# Altium schematic sheet OSP_Carrier_V8_Power.SchDoc: OSP_Carrier_V8
size B; ApprovedBy: HARI; Engineer: LP; Organization: THE_Lab; DocumentNumber: 1; Revision: 1; SheetNumber: 1; SheetTotal: 1
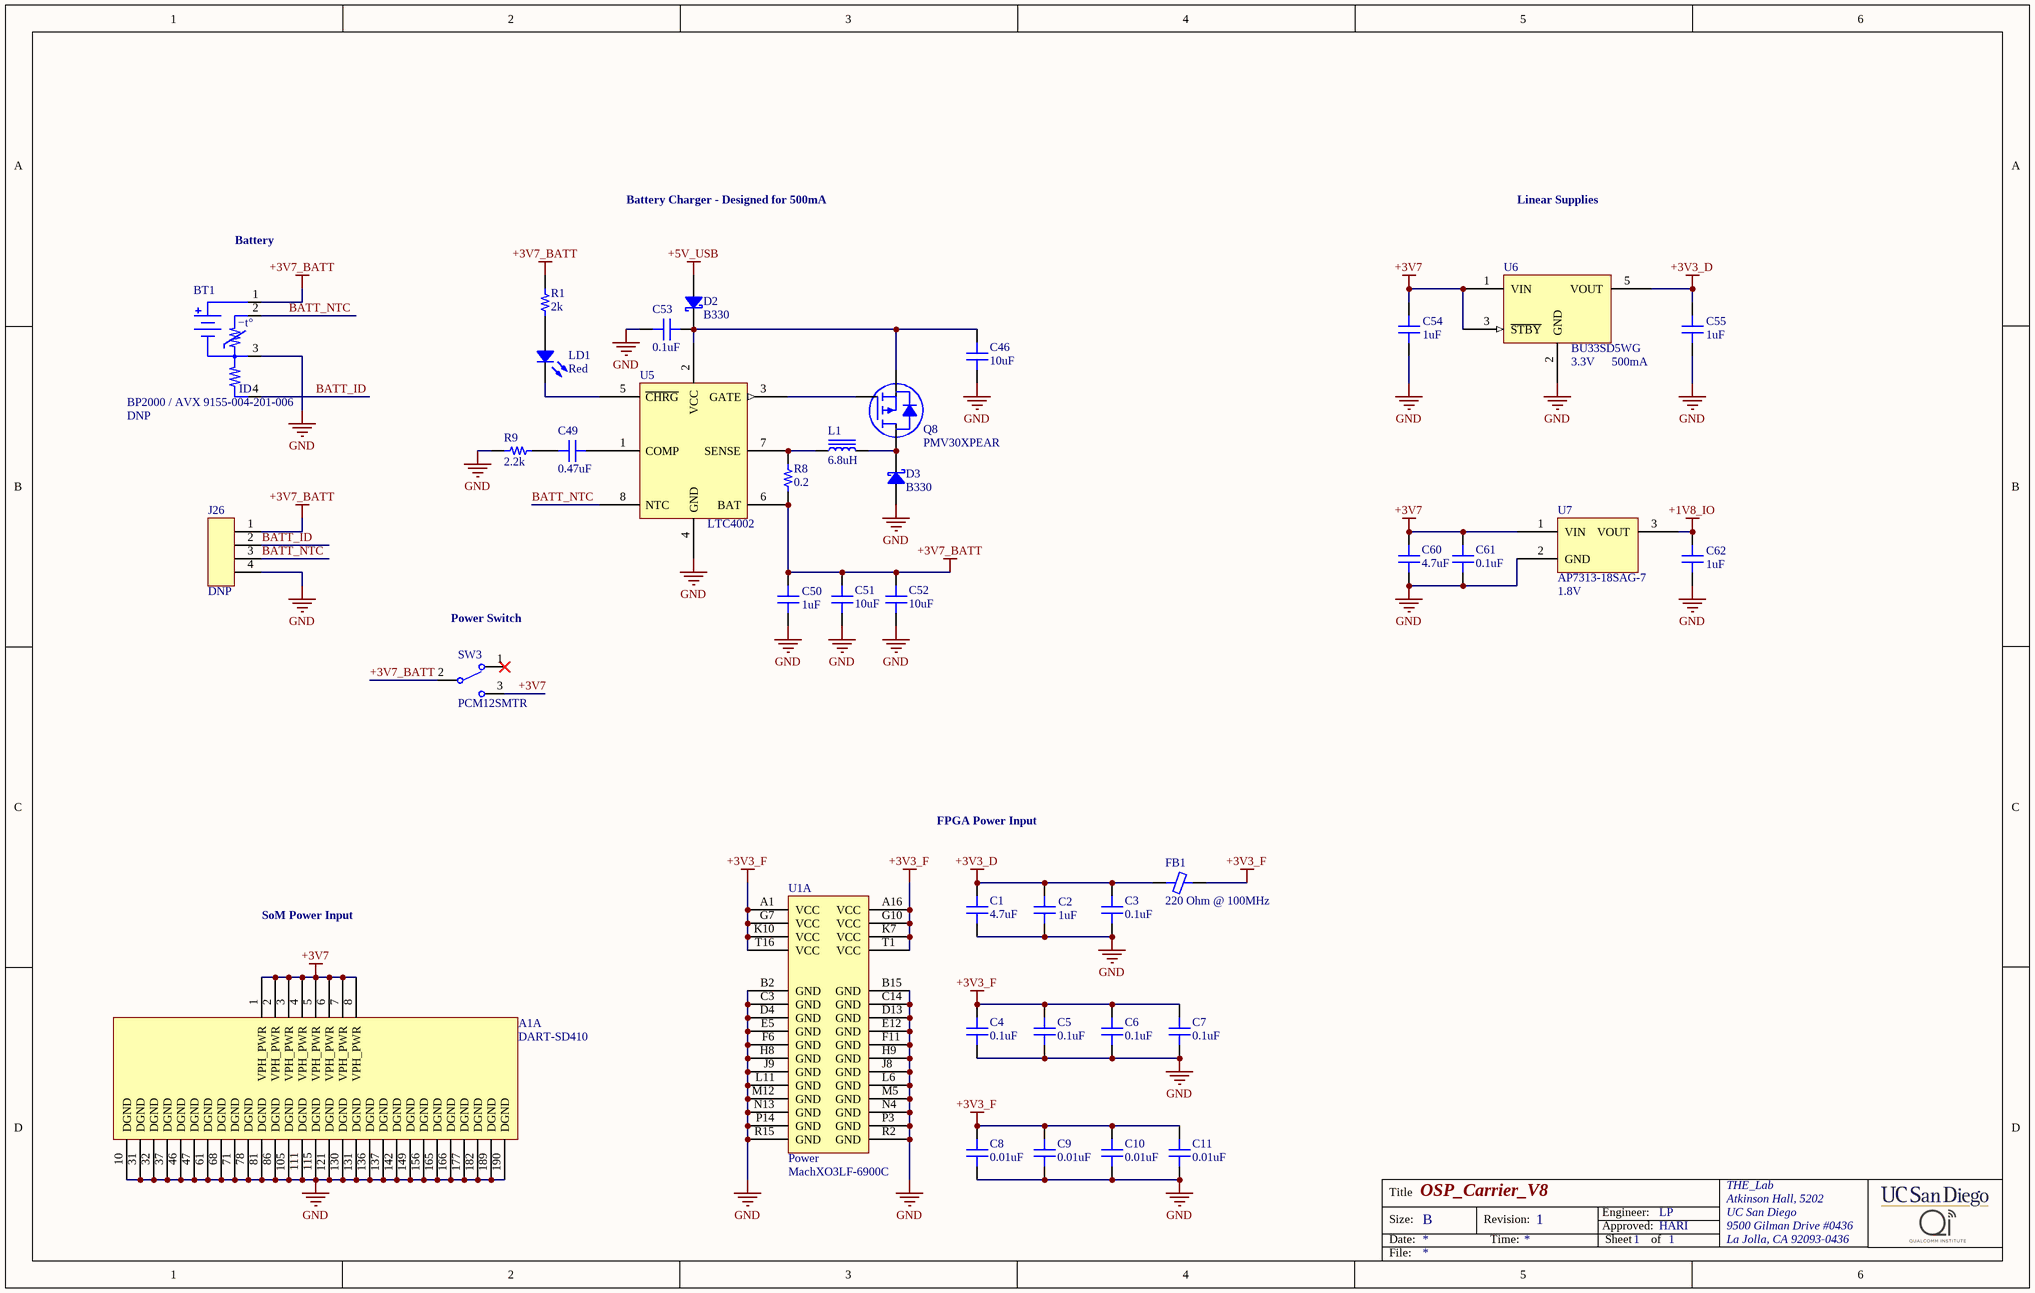
[diagram p0: OSP_Carrier_V8_Power.SchDoc]

## Parts
A1  DART-SD410  [DART-SD410]  (part A of 15)
BT1  BP2000 / AVX 9155-004-201-006  [SAMSUNG_BP2000]
C1  4.7uF  [CAP 0402/1005]
C2  1uF  [CAP 0402/1005]
C3  0.1uF  [CAP 0402/1005]
C4  0.1uF  [CAP 0402/1005]
C5  0.1uF  [CAP 0402/1005]
C6  0.1uF  [CAP 0402/1005]
C7  0.1uF  [CAP 0402/1005]
C8  0.01uF  [CAP 0402/1005]
C9  0.01uF  [CAP 0402/1005]
C10  0.01uF  [CAP 0402/1005]
C11  0.01uF  [CAP 0402/1005]
C46  10uF  [CAP 1206/3216]
C49  0.47uF  [CAP 0402/1005]
C50  1uF  [CAP 0402/1005]
C51  10uF  [CAP 1206/3216]
C52  10uF  [CAP 1206/3216]
C53  0.1uF  [CAP 0402/1005]
C54  1uF  [CAP 0402/1005]
C55  1uF  [CAP 0402/1005]
C60  4.7uF  [CAP 0402/1005]
C61  0.1uF  [CAP 0402/1005]
C62  1uF  [CAP 0402/1005]
D2  B330  [DO214AC SMA]
D3  B330  [DO214AC SMA]
FB1  220 Ohm @ 100MHz  [FER 0402/1005]
J26  Shallow  [AMPHENOL_10125839-04RAEHLF_DNP]  (value not drawn)
L1  6.8uH  [LAIRD_TYS6028]
LD1  Red  [LED 0603/1608 RED]
Q8  PMV30XPEAR  [NXP_SOT23]
R1  2k  [RES 0402/1005]
R8  0.2  [STACKPOLE CSR1206]
R9  2.2k  [RES 0402/1005]
SW3  PCM12SMTR  [*SW_PCM12SMTR_PCM12SMTR(Primary)]
U1  MachXO3LF-6900C  [LCMXO3_caBGA_BG256]  (part A of 7)
U5  LTC4002  [AD_LT_S8]
U6  BU33SD5WG  VOLTAGE: 3.3V  CURRENT: 500mA  [ROHM_SSOP5]
U7  AP7313-18SAG-7  Voltage - Output: 1.8V  [DIODES SOT-23-3]

## Nets
+1V8_IO: C62.1 U7.3(VOUT)
+3V3_D: C1.2 C2.1 C3.2 C55.1 FB1.1 U6.5(VOUT)
+3V3_F: C4.2 C5.2 C6.2 C7.2 C8.2 C9.2 C10.2 C11.2 FB1.2 U1.A1(VCC) U1.A16(VCC) U1.G7(VCC) U1.G10(VCC) U1.K7(VCC) U1.K10(VCC) U1.T1(VCC) U1.T16(VCC)
+3V7: A1.1(VPH_PWR) A1.2(VPH_PWR) A1.3(VPH_PWR) A1.4(VPH_PWR) A1.5(VPH_PWR) A1.6(VPH_PWR) A1.7(VPH_PWR) A1.8(VPH_PWR) C54.1 C60.2 C61.2 SW3.3 U6.1(VIN) U6.3(~{STBY}) U7.1(VIN)
+3V7_BATT: BT1.1(+) C50.1 C51.1 C52.1 J26.1 R1.2 R8.1 SW3.2 U5.6(BAT)
+5V_USB: D2.1
GND: A1.10(DGND) A1.31(DGND) A1.32(DGND) A1.37(DGND) A1.46(DGND) A1.47(DGND) A1.61(DGND) A1.68(DGND) A1.71(DGND) A1.78(DGND) A1.81(DGND) A1.86(DGND) A1.105(DGND) A1.111(DGND) A1.115(DGND) A1.121(DGND) A1.130(DGND) A1.131(DGND) A1.136(DGND) A1.137(DGND) A1.142(DGND) A1.149(DGND) A1.156(DGND) A1.165(DGND) A1.166(DGND) A1.177(DGND) A1.182(DGND) A1.189(DGND) A1.190(DGND) BT1.3(−) C1.1 C2.2 C3.1 C4.1 C5.1 C6.1 C7.1 C8.1 C9.1 C10.1 C11.1 C46.2 C50.2 C51.2 C52.2 C53.2 C54.2 C55.2 C60.1 C61.1 C62.2 D3.1 J26.4 R9.2 U1.B2(GND) U1.B15(GND) U1.C3(GND) U1.C14(GND) U1.D4(GND) U1.D13(GND) U1.E5(GND) U1.E12(GND) U1.F6(GND) U1.F11(GND) U1.H8(GND) U1.H9(GND) U1.J8(GND) U1.J9(GND) U1.L6(GND) U1.L11(GND) U1.M5(GND) U1.M12(GND) U1.N4(GND) U1.N13(GND) U1.P3(GND) U1.P14(GND) U1.R2(GND) U1.R15(GND) U5.4(GND) U6.2(GND) U7.2(GND)
BATT_ID: BT1.4(ID) J26.2
BATT_NTC: BT1.2(NTC) J26.3 U5.8(NTC)
NetC46_1: C46.1 C53.1 D2.2 Q8.2(S) U5.2(VCC)
NetC49_1: C49.1 U5.1(COMP)
NetC49_2: C49.2 R9.1
NetD3_2: D3.2 L1.2 Q8.3(D)
NetL1_1: L1.1 R8.2 U5.7(SENSE)
NetLD1_1: LD1.1 R1.1
NetLD1_2: LD1.2 U5.5(~{CHRG})
NetQ8_1: Q8.1(G) U5.3(GATE)

Not connected (* = marked no-connect by the designer): SW3 1*

## Notes on the sheet
- Battery Charger - Designed for 500mA
- Linear Supplies
- Battery
- (near SW3) Power Switch
- FPGA Power Input
- SoM Power Input
- Title
- Size:
- Date:
- B
- Revision:
- Time:
- Engineer:
- Approved:
- Sheet
- of
- THE_Lab
- Atkinson Hall, 5202
- UC San Diego
- 9500 Gilman Drive #0436
- La Jolla, CA 92093-0436
- File:
- (in symbol LCMXO3LF-6900C-XBG256X, part A) Power
- (in symbol SAMSUNG_BP2000) −t°

## Library data of the parts
A1 = DART-SD410: Variscite DART-SD410 System on Module
BT1 = SAMSUNG_BP2000: Samsung BP2000 2000mAh battery for Galaxy Camera 2, connector AVX 9155-004-201-006; DNP: DNP
C1 C60 = C1005X5R1A475K050BC: CAP CER 4.7UF 10V X5R 0402; Manufacturer: TDK Corporation; TemperatureRange: -55C ~ 85C; Tolerance: 10%; Value: 4.7uF; Part Number: C1005X5R1A475K050BC; PartId: 12382; Supplier 1: Digi-Key; Supplier Part Number 1: 445-13820-2-ND; ComponentLink1Description: Datasheet; ComponentLink1URL: https://product.tdk.com/info/en/catalog/datasheets/mlcc_commercial_general_en.pdf; ComponentLink2Description: Digi-Key Listing; ComponentLink2URL: https://www.digikey.com/product-detail/en/tdk-corporation/C1005X5R1A475K050BC/445-13820-2-ND/3951056; TemperatureCoefficient: X5R; Voltage: 10V; Price: 0.096; Device Package: 0402 (1005 Metric)
C2 C50 C54 C55 C62 = GRM155R61A105KE15D: CAP CER 1UF 10V X5R 0402; Manufacturer: Murata Electronics North America; TemperatureRange: -55C ~ 85C; Tolerance: 10%; Value: 1uF; Part Number: GRM155R61A105KE15D; PartId: 12338; Supplier 1: Digi-Key; Supplier Part Number 1: 490-3890-2-ND; ComponentLink1Description: Datasheet; ComponentLink1URL: http://www.murata.com/~/media/webrenewal/support/library/catalog/products/capacitor/mlcc/c02e.pdf; ComponentLink2Description: Digi-Key Listing; ComponentLink2URL: https://www.digikey.com/product-detail/en/murata-electronics-north-america/GRM155R61A105KE15D/490-3890-2-ND/965904; TemperatureCoefficient: X5R; Voltage: 10V; Price: 0.0069; Device Package: 0402 (1005 Metric)
C3-C7 C53 C61 = C1005X7R1H104K050BB: CAP CER 0.1UF 50V X7R 0402; Manufacturer: TDK Corporation; TemperatureRange: -55C ~ 125C; Tolerance: 10%; Value: 0.1uF; Part Number: C1005X7R1H104K050BB; PartId: 3860; Supplier 1: Digi-Key; Supplier Part Number 1: 445-5932-2-ND; ComponentLink1Description: Datasheet; ComponentLink1URL: https://product.tdk.com/info/en/catalog/datasheets/mlcc_commercial_general_en.pdf; ComponentLink2Description: Digi-Key listing; ComponentLink2URL: http://digikey.com/product-detail/en/C1005X7R1H104K050BB/445-5932-2-ND/2443410; TemperatureCoefficient: X7R; Voltage: 50V; Price: 0.0287; Type: -; Device Package: 0402 (1005 Metric)
C8-C11 = CC0402KRX7R8BB103: CAP CER 10000PF 25V X7R 0402; Manufacturer: Yageo; TemperatureRange: -55C ~ 125C; Tolerance: 10%; Value: 0.01uF; Part Number: CC0402KRX7R8BB103; PartId: 12361; Supplier 1: Digi-Key; Supplier Part Number 1: 311-1337-2-ND; ComponentLink1Description: Datasheet; ComponentLink1URL: http://www.yageo.com/documents/recent/UPY-GPHC_X7R_6.3V-to-50V_13.pdf; ComponentLink2Description: Digi-Key Listing; ComponentLink2URL: https://www.digikey.com/product-detail/en/yageo/CC0402KRX7R8BB103/311-1337-2-ND/2103075; TemperatureCoefficient: X7R; Voltage: 25V; Price: 0.0017; Device Package: 0402 (1005 Metric)
C46 C51 C52 = C1206C106M3RACTU: CAP CER 10UF 25V X7R 1206; Manufacturer: Kemet; TemperatureRange: -55C ~ 125C; Tolerance: 20%; Value: 10uF; Part Number: C1206C106M3RACTU; PartId: 6235; Supplier 1: Digi-Key; Supplier Part Number 1: 399-7443-2-ND; ComponentLink1Description: Datasheet; ComponentLink1URL: http://www.kemet.com/docfinder?Partnumber=C1206C106M3RACTU; ComponentLink2Description: Digi-Key listing; ComponentLink2URL: http://digikey.com/product-detail/en/C1206C106M3RACTU/399-7443-2-ND/3317649; TemperatureCoefficient: X7R; Voltage: 25V; Price: 0.2272; Type: -; Device Package: 1206 (3216 Metric)
C49 = GRM155R61A474KE15D: CAP CER 0.47UF 10V X5R 0402; Manufacturer: Murata Electronics North America; TemperatureRange: -55C ~ 85C; Tolerance: 10%; Value: 0.47uF; Part Number: GRM155R61A474KE15D; PartId: 12351; Supplier 1: Digi-Key; Supplier Part Number 1: 490-3264-2-ND; ComponentLink1Description: Datasheet; ComponentLink1URL: http://www.murata.com/~/media/webrenewal/support/library/catalog/products/capacitor/mlcc/c02e.pdf; ComponentLink2Description: Digi-Key Listing; ComponentLink2URL: https://www.digikey.com/product-detail/en/murata-electronics-north-america/GRM155R61A474KE15D/490-3264-2-ND/702528; TemperatureCoefficient: X5R; Voltage: 10V; Price: 0.0121; Device Package: 0402 (1005 Metric)
D2 D3 = B330A: B330AE-13 Schottky Diode 3A 30V
FB1 = CIM05U221NC: FERRITE CHIP 220 OHM 500MA 0402; Manufacturer: Samsung Electro-Mechanics America, Inc.; Type: Differential Mode - Single; DC Resistance: 350 mOhm Max; Part Number: CIM05U221NC; PartId: 6444; Value: 220 Ohm @ 100MHz; Supplier 1: Digi-Key; Supplier Part Number 1: 1276-6344-2-ND; ComponentLink1Description: Datasheet; ComponentLink1URL: http://www.samsungsem.com/kr/front/downloadcms.do?path=/kr/support/product-search/bead/__icsFiles/afieldfile/2014/11/13&fileName=S_CIM05J102NC.pdf; ComponentLink2Description: Digi-Key listing; ComponentLink2URL: http://digikey.com/product-detail/en/CIM05U221NC/1276-6344-2-ND/3973776; Price: 0.0073; Device Package: 0402 (1005 Metric); Current Rating: 500mA
J26 = AMPHENOL_10125839-04RAEHLF_DNP: Amphenol 10125839-04RAEHLF (Do Not Populate); DNP: DNP
L1 = Laird_TYS60286R8M-10: Laird TYS60286R8M-10 6.8uH 2.4A 47mOhms
LD1 = LTST-C191KRKT: LED RED CLEAR 0603 SMD; Manufacturer: Lite-On Inc.; Value: Green; Millicandela: 54mcd; Voltage Forward: 2V; Current (Test): 20mA; Viewing Angle: 130; Part Number: LTST-C191KRKT; PartId: 7050; Supplier 1: Digi-Key; Supplier Part Number 1: 160-1447-2-ND; ComponentLink1Description: Datasheet; ComponentLink1URL: http://optoelectronics.liteon.com/upload/download/DS22-2000-223/S_110_LTST-C191KRKT.pdf; ComponentLink2Description: Digi-Key Listing; ComponentLink2URL: http://www.digikey.ca/product-detail/en/LTST-C191KRKT/160-1447-2-ND/386837; Price: 0.0521; Device Package: 0603 (1608 Metric); Colour: Red; Lens Transparency: Clear
Q8 = NXP_PMV30XPEAR: PMV30XPEAR PMOS 20V -5.3A 28mOhms
R1 = ERJ-2RKF2001X: RES SMD 2K OHM 1% 1/10W 0402; Manufacturer: Panasonic Electronic Components; TemperatureRange: -55C ~ 155C; TemperatureCoefficient: 100ppm/C; PowerRating: 0.1W, 1/10W; Value: 2k; Part Number: ERJ-2RKF2001X; PartId: 16; Supplier 1: Digi-Key; Supplier Part Number 1: P2.00KLTR-ND; ComponentLink1Description: Datasheet; ComponentLink1URL: http://industrial.panasonic.com/www-cgi/jvcr13pz.cgi?E+PZ+3+AOA0002+ERJ2RKF2001X+7+WW; ComponentLink2Description: Digikey listing; ComponentLink2URL: http://digikey.com/product-detail/en/ERJ-2RKF2001X/P2.00KLTR-ND/192194; Tolerance: 1%; Price: 0.0043; Type: Thick Film; Device Package: 0402 (1005 Metric)
R8 = CSR1206FKR200: RES SMD 0.2 OHM 1% 1/2W 1206; Manufacturer: Stackpole Electronics Inc.; TemperatureRange: -55C ~ 155C; TemperatureCoefficient: 100ppm/C; PowerRating: 0.5W, 1/2W; Value: 0.2; Part Number: CSR1206FKR200; PartId: 9964; Supplier 1: Digi-Key; Supplier Part Number 1: CSR1206FKR200TR-ND; ComponentLink1Description: Datasheet; ComponentLink1URL: http://www.seielect.com/catalog/SEI-CSR_CSRN.pdf; ComponentLink2Description: Digi-Key Listing; ComponentLink2URL: https://www.digikey.com/product-detail/en/stackpole-electronics-inc/CSR1206FKR200/CSR1206FKR200TR-ND/1742391; Tolerance: 1%; Price: 0.072; Device Package: 1206 (3216 Metric)
R9 = ERJ-2RKF2201X: RES SMD 2.2K OHM 1% 1/10W 0402; Manufacturer: Panasonic Electronic Components; TemperatureRange: -55C ~ 155C; TemperatureCoefficient: 100ppm/C; PowerRating: 0.1W, 1/10W; Value: 2.2k; Part Number: ERJ-2RKF2201X; PartId: 8; Supplier 1: Digi-Key; Supplier Part Number 1: P2.20KLTR-ND; ComponentLink1Description: Datasheet; ComponentLink1URL: http://industrial.panasonic.com/www-cgi/jvcr13pz.cgi?E+PZ+3+AOA0002+ERJ2RKF2201X+7+WW; ComponentLink2Description: Digikey listing; ComponentLink2URL: http://digikey.com/product-detail/en/ERJ-2RKF2201X/P2.20KLTR-ND/1746150; Tolerance: 1%; Price: 0.0043; Type: Thick Film; Device Package: 0402 (1005 Metric)
U1 = LCMXO3LF-6900C-XBG256X: Lattice MachXO3LF-6900C-5BG256C FPGA
U5 = LTC4002: Analog / Linear 1.5A Single Cell Li-Ion Battery Charger
U6 = ROHM_BU33SD5WG: ROHM BU33SD5WG-TR 3.3V 500mA LDO
U7 = AP7313-18SAG-7: IC REG LDO 1.8V 0.15A SOT23-3; Manufacturer: Diodes Incorporated; Topology: Positive Fixed; Voltage - Input: 2 V ~ 6 V; Current - Limit (Min): 200mA; Part Number: AP7313-18SAG-7; PartId: 7912; Supplier 1: Digi-Key; Supplier Part Number 1: AP7313-18SAG-7DITR-ND; ComponentLink1Description: Datasheet; ComponentLink1URL: http://www.diodes.com/_files/datasheets/AP7313.pdf; ComponentLink2Description: Digi-Key Listing; ComponentLink2URL: http://www.digikey.ca/product-detail/en/AP7313-18SAG-7/AP7313-18SAG-7DITR-ND/2270804; Price: 0.1675; Device Package: TO-236-3, SC-59, SOT-23-3; Voltage Dropout: -; Operating Temperature: -40C ~ 85C